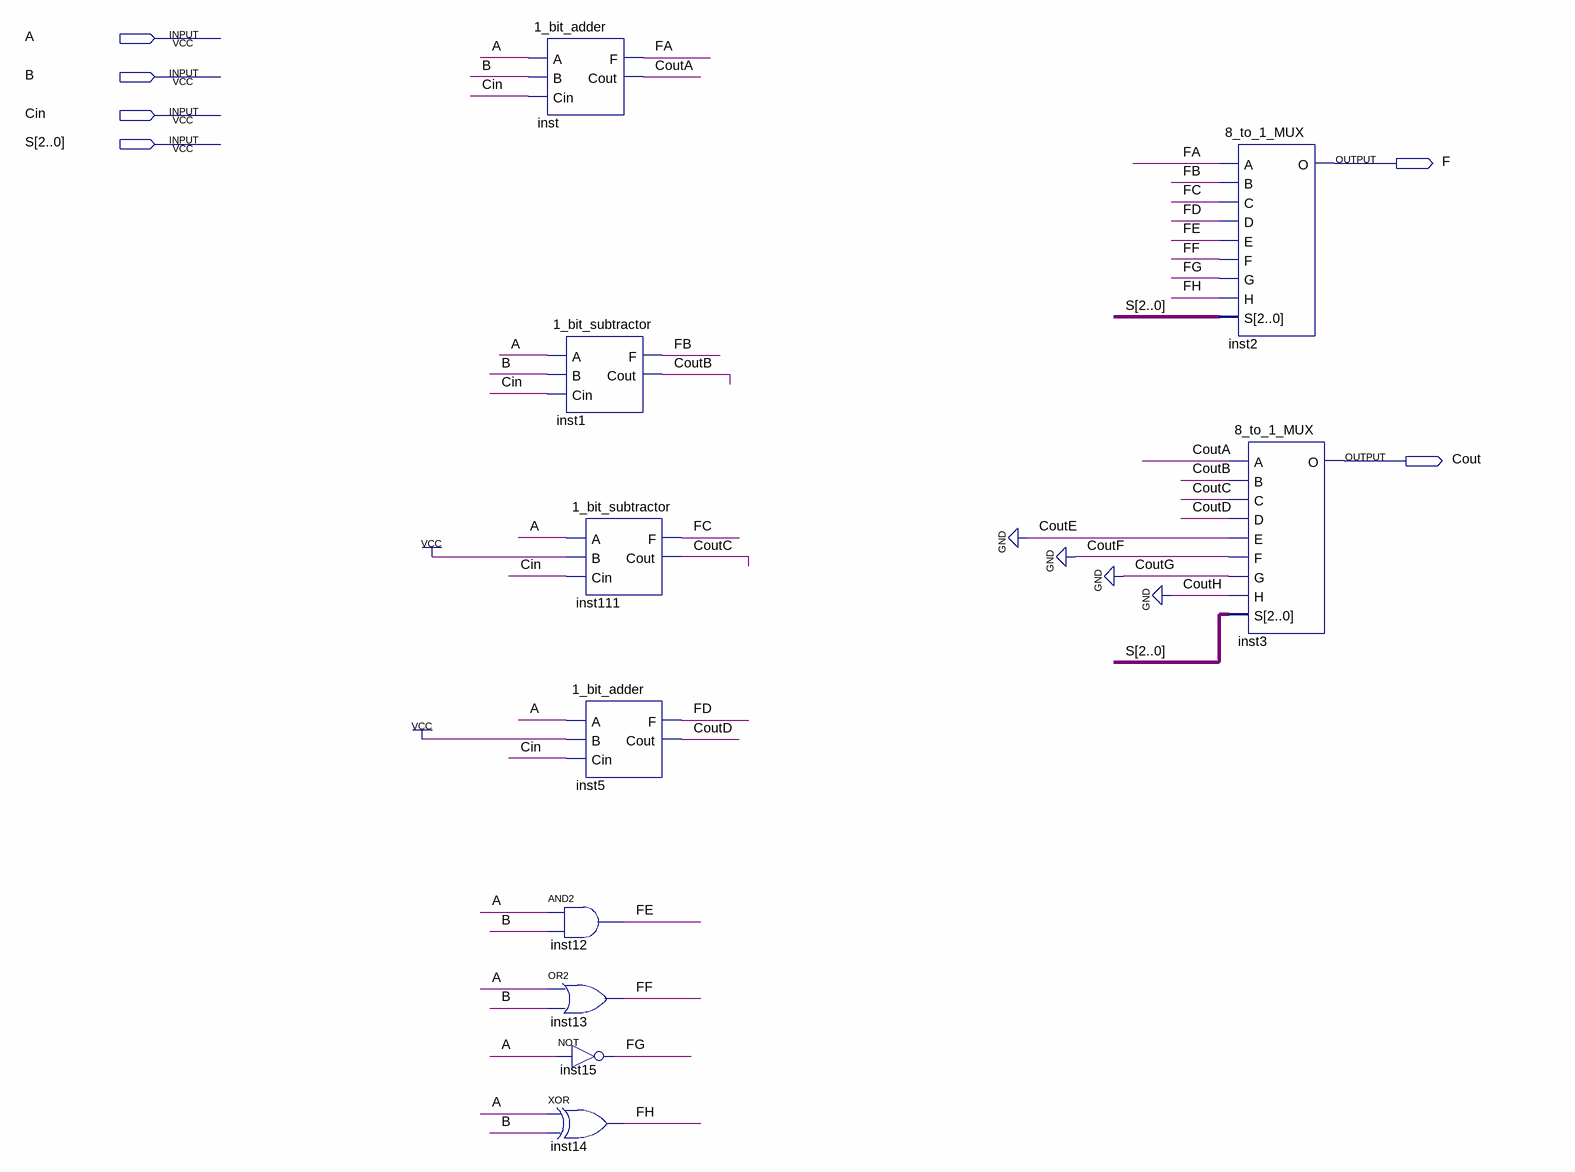
[diagram p0: schematic sheet]
// Quartus schematic 1_bit_alu.bdf as structural Verilog: 10 symbols, 6 pins
module \1_bit_alu  (
  input  A,
  input  B,
  input  Cin,
  input  [2:0] S,
  output F,
  output Cout
);

  wire CoutA, CoutB, CoutC, CoutD, FA, FB, FC, FD, FE, FF, FG, FH;

  \1_bit_adder  inst (.A(A), .B(B), .Cin(Cin), .F(FA), .Cout(CoutA));
  \1_bit_subtractor  inst1 (.A(A), .B(B), .Cin(Cin), .F(FB), .Cout(CoutB));
  \1_bit_subtractor  inst111 (.A(A), .B(1'b1), .Cin(Cin), .F(FC), .Cout(CoutC));
  \1_bit_adder  inst5 (.A(A), .B(1'b1), .Cin(Cin), .F(FD), .Cout(CoutD));
  and inst12 (FE, A, B);
  or inst13 (FF, A, B);
  not inst15 (FG, A);
  xor inst14 (FH, A, B);
  \8_to_1_MUX  inst2 (.A(FA), .B(FB), .C(FC), .D(FD), .E(FE), .F(FF), .G(FG), .H(FH), .S(S), .O(F));
  \8_to_1_MUX  inst3 (
    .A(CoutA), .B(CoutB), .C(CoutC), .D(CoutD), .E(1'b0), .F(1'b0), .G(1'b0), .H(1'b0), .S(S), .O(Cout));
endmodule
